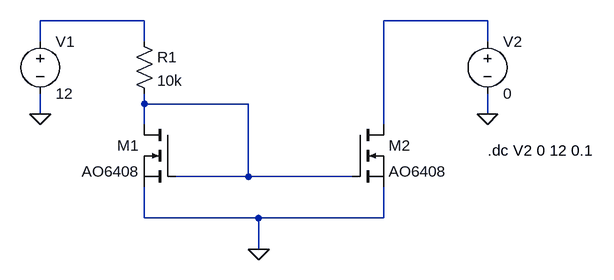
[diagram p0: schematic Current_mirror.asc]
Current_mirror.asc, the LTspice schematic file:
Version 4.1
SHEET 1 880 680
WIRE 144 -48 -16 -48
WIRE 672 -48 512 -48
WIRE -16 -16 -16 -48
WIRE 144 -16 144 -48
WIRE 672 -16 672 -48
WIRE 144 80 144 64
WIRE 304 80 144 80
WIRE -16 96 -16 64
WIRE 672 96 672 64
WIRE 144 112 144 80
WIRE 512 112 512 -48
WIRE 304 192 304 80
WIRE 304 192 192 192
WIRE 464 192 304 192
WIRE 144 256 144 208
WIRE 320 256 144 256
WIRE 512 256 512 208
WIRE 512 256 320 256
WIRE 320 304 320 256
FLAG -16 96 0
FLAG 320 304 0
FLAG 672 96 0
SYMBOL nmos 464 112 R0
SYMATTR InstName M2
SYMATTR Value AO6408
SYMBOL res 128 -32 R0
SYMATTR InstName R1
SYMATTR Value 10k
SYMBOL nmos 192 112 M0
SYMATTR InstName M1
SYMATTR Value AO6408
SYMBOL voltage -16 -32 R0
WINDOW 123 0 0 Left 0
WINDOW 39 0 0 Left 0
SYMATTR InstName V1
SYMATTR Value 12
SYMBOL voltage 672 -32 R0
WINDOW 123 0 0 Left 0
WINDOW 39 0 0 Left 0
SYMATTR InstName V2
SYMATTR Value 0
TEXT 672 152 Left 2 !.dc V2 0 12 0.1

The netlist it stands for:
* Current_mirror.asc
M2 N002 N003 0 0 AO6408
R1 N001 N003 10k
M1 N003 N003 0 0 AO6408
V1 N001 0 12
V2 N002 0 0
.model NMOS NMOS
.model PMOS PMOS
.lib standard.mos
.dc V2 0 12 0.1
.backanno
.end